# Altium schematic sheet TI_MAIN.SchDoc
size A0
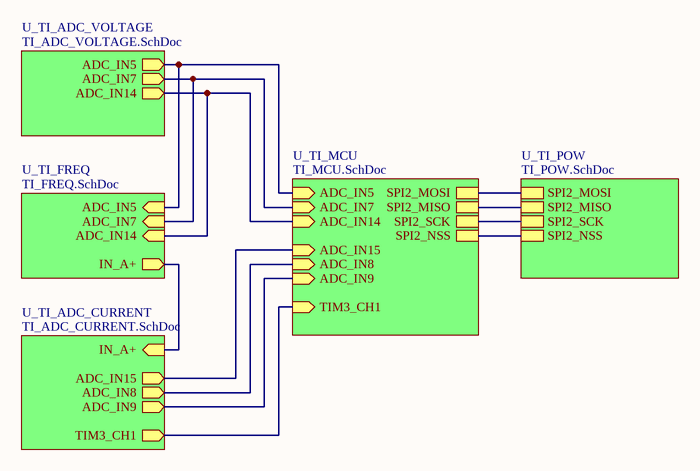
[diagram p0: TI_MAIN.SchDoc]

## Sub-sheets
U_TI_ADC_CURRENT = TI_ADC_CURRENT.SchDoc: ADC_IN15 (out), IN_A+ (in), TIM3_CH1 (out), ADC_IN8 (out), ADC_IN9 (out)
U_TI_ADC_VOLTAGE = TI_ADC_VOLTAGE.SchDoc: ADC_IN5 (out), ADC_IN7 (out), ADC_IN14 (out)
U_TI_FREQ = TI_FREQ.SchDoc: IN_A+ (out), ADC_IN5 (in), ADC_IN7 (in), ADC_IN14 (in)
U_TI_MCU = TI_MCU.SchDoc: SPI2_MOSI, SPI2_MISO, SPI2_SCK, SPI2_NSS, ADC_IN14 (in), TIM3_CH1 (in), ADC_IN15 (in), ADC_IN8 (in), ADC_IN5 (in), ADC_IN7 (in), ADC_IN9 (in)
U_TI_POW = TI_POW.SchDoc: SPI2_MOSI, SPI2_MISO, SPI2_SCK, SPI2_NSS

## Nets
(unnamed): sheet U_TI_MCU/SPI2_MOSI, sheet U_TI_POW/SPI2_MOSI
(unnamed): sheet U_TI_MCU/SPI2_MISO, sheet U_TI_POW/SPI2_MISO
(unnamed): sheet U_TI_MCU/SPI2_SCK, sheet U_TI_POW/SPI2_SCK
(unnamed): sheet U_TI_MCU/SPI2_NSS, sheet U_TI_POW/SPI2_NSS
(unnamed): sheet U_TI_MCU/ADC_IN14, sheet U_TI_ADC_VOLTAGE/ADC_IN14, sheet U_TI_FREQ/ADC_IN14
(unnamed): sheet U_TI_MCU/TIM3_CH1, sheet U_TI_ADC_CURRENT/TIM3_CH1
(unnamed): sheet U_TI_MCU/ADC_IN15, sheet U_TI_ADC_CURRENT/ADC_IN15
(unnamed): sheet U_TI_MCU/ADC_IN8, sheet U_TI_ADC_CURRENT/ADC_IN8
(unnamed): sheet U_TI_MCU/ADC_IN5, sheet U_TI_ADC_VOLTAGE/ADC_IN5, sheet U_TI_FREQ/ADC_IN5
(unnamed): sheet U_TI_MCU/ADC_IN7, sheet U_TI_ADC_VOLTAGE/ADC_IN7, sheet U_TI_FREQ/ADC_IN7
(unnamed): sheet U_TI_MCU/ADC_IN9, sheet U_TI_ADC_CURRENT/ADC_IN9
(unnamed): sheet U_TI_ADC_CURRENT/IN_A+, sheet U_TI_FREQ/IN_A+